# Altium schematic sheet Voeding.SchDoc
size A4; SheetNumber: 2; SheetTotal: 2
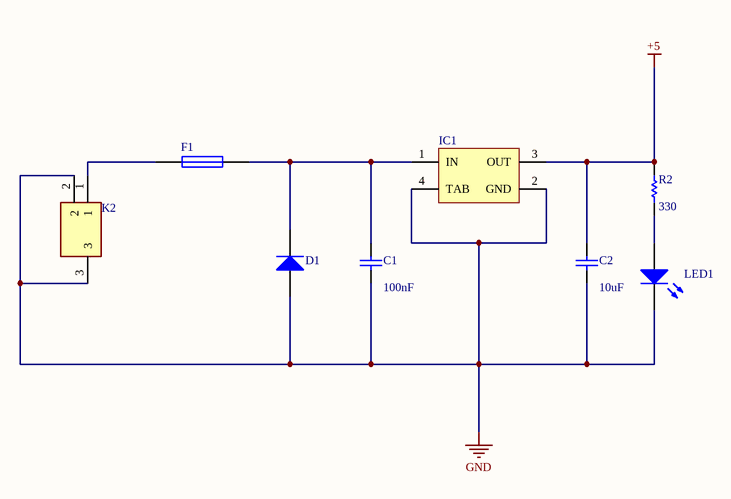
[diagram p0: Voeding.SchDoc]

## Parts
C1  value 100nF  [6-0805_M]  (hidden comment: Cap)
C2  value 10uF  [CAP_EEV-FK1K101V]  (hidden comment: Cap)
D1  Diode 1N4004  [DO-41]  (value not drawn)
F1  Fuse 1  [CAPC3216X94N]  (value not drawn)
IC1  LM3940IMP-3.3  [DCY0004A_L]  (value not drawn)
K2  MJ-180PH  [MJ-180PH]  (value not drawn)
LED1  LED0  [LED-0]  (value not drawn)
R2  value 330  [6-0805_M]  (hidden comment: Res1)

## Nets
+5: C2.2 IC1.3(OUT) R2.2
GND: C1.1 C2.1 D1.1(A) IC1.2(GND) IC1.4(TAB) K2.2 K2.3 LED1.2(K)
NetC1_2: C1.2 D1.2(K) F1.2 IC1.1(IN)
NetF1_1: F1.1 K2.1
NetLED1_1: LED1.1(A) R2.1

## Library data of the parts
C1 C2 = Cap: Capacitor; Published: 8-Jun-2000; LatestRevisionDate: 17-Jul-2002; LatestRevisionNote: Re-released for DXP Platform.; PackageReference: RAD-0.3; Publisher: Altium Limited; PackageDescription: Radial Cap, Thru-Hole; 2 Leads; 0.3 in Pin Spacing
D1 = Diode 1N4004: 1 Amp General Purpose Rectifier; Published: 8-Jun-2000; LatestRevisionDate: 17-Jul-2002; LatestRevisionNote: Re-released for DXP Platform.; DatasheetVersion: 1998; PackageVersion: Aug-1999; PackageReference: DO-41; Publisher: Altium Limited; PackageDescription: Diode, Axial; Body 5.2 x 2.7 mm (LxDia. max), Lead Dia. 0.86 mm (max); Code_JEDEC: DO-204-AL; ComponentLink1Description: Manufacturer Link; ComponentLink1URL: http://www.fairchildsemi.com/; ComponentLink2Description: Datasheet; ComponentLink2URL: http://www.fairchildsemi.com/ds/1N%2F1N4001.pdf
F1 = Fuse 1: Fuse; Published: 8-Jun-2000; LatestRevisionDate: 17-Jul-2002; LatestRevisionNote: Re-released for DXP Platform.; PackageReference: PIN-W2/E2.8; Publisher: Altium Limited; PackageDescription: Thru-Hole; 2 Leads
IC1 = CMP-0062-01793-3: 1A Low Dropout Regulator for 5V to 3.3V Conversion, 4-pin SOT-223; Manufacturer: Texas Instruments; PackageTopMarking: XYTT*L52B; CompType: LDO IC; PowerWise: N; Code_JEDEC: TO-261-AA; PackageDescription: Molded SOT-223, 6.50 x 3.56 x 1.6mm Body, 4 Lead, 2.3mm Pitch; PinCount: 4; ComponentLink1Description: Datasheet URL; PackageReference: DCY0004A; Code_IPC: SOT223-4; ComponentLink1URL: http://www.ti.com/general/docs/lit/getliterature.tsp?genericPartNumber=LM3940&fileType=pdf; RoHS: N
K2 = MJ-180PH: Connector; Manufacturer_Name: MULTICOMP; Datasheet Link: http://www.farnell.com/datasheets/1910033.pdf; Manufacturer_Part_Number: MJ-180PH
LED1 = LED0: Typical INFRARED GaAs LED; Published: 8-Jun-2000; LatestRevisionDate: 08-Jul-2005; LatestRevisionNote: Mech Layer 1 removed.; PackageReference: LED-0; Publisher: Altium Limited; PackageDescription: LED; 2 Leads
R2 = Res1: Resistor; Published: 8-Jun-2000; LatestRevisionDate: 17-Jul-2002; LatestRevisionNote: Re-released for DXP Platform.; PackageReference: AXIAL-0.3; Publisher: Altium Limited; PackageDescription: Axial Device, Thru-Hole; 2 Leads; 0.3 in Pin Spacing